# Altium project Sirius_Black.PrjPcb (part 1 of 2)
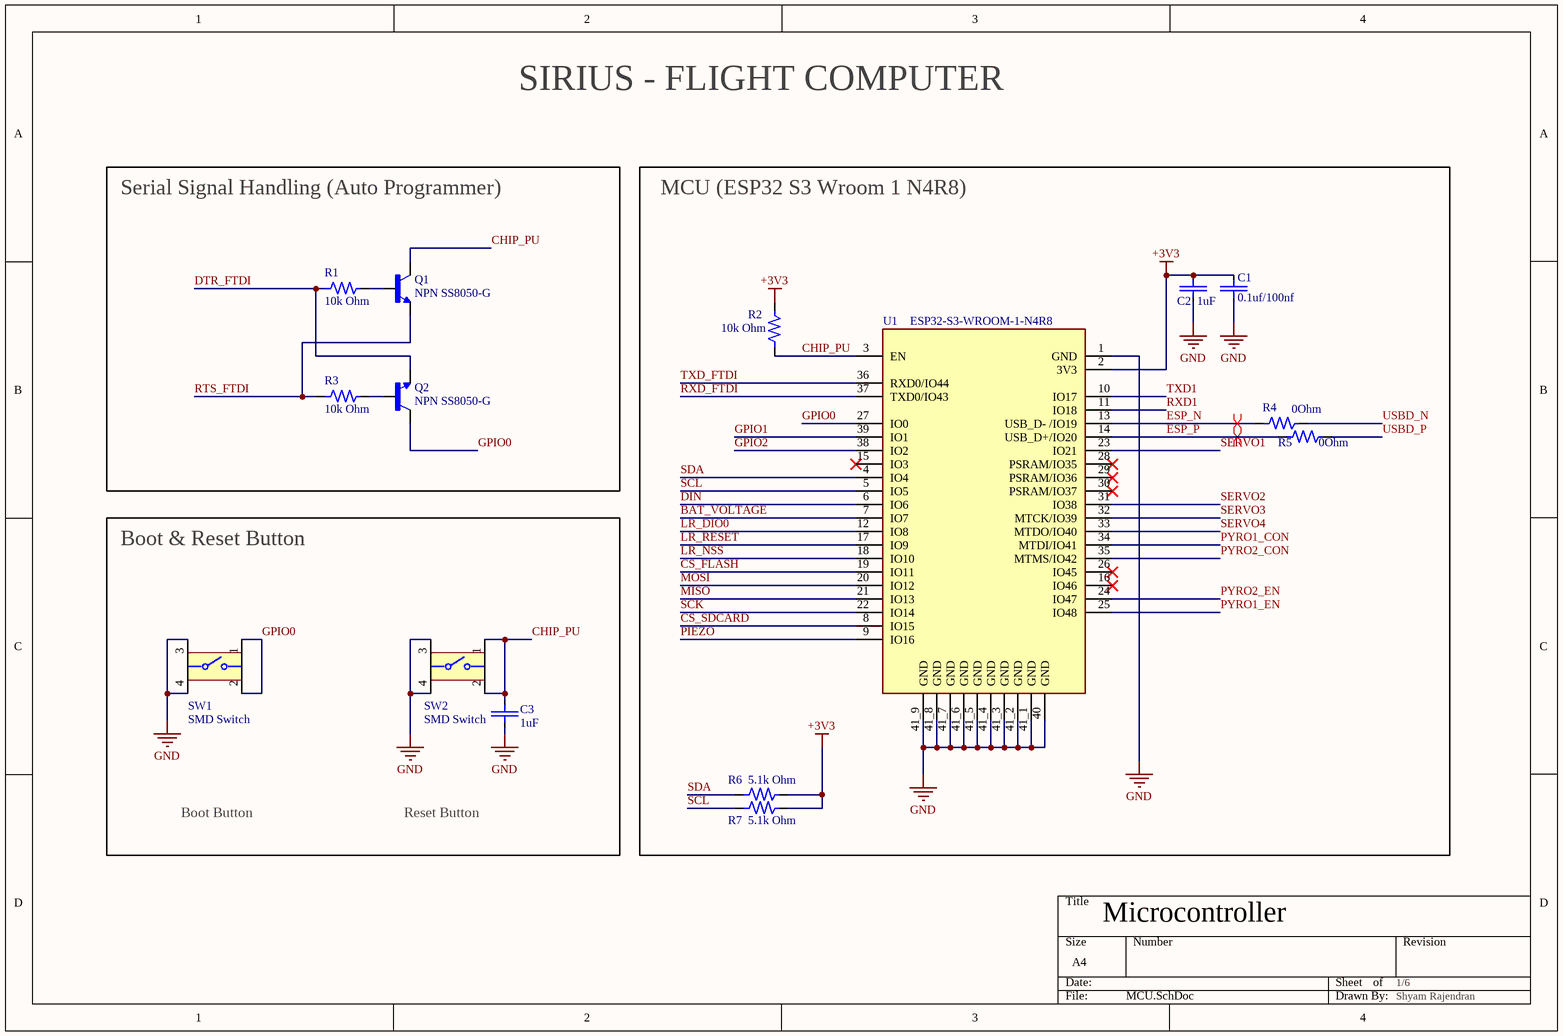
[diagram p0: MCU.SchDoc]
6 sheets, 175 parts. Net scope: global (net labels, ports and power ports of the same name join across sheets).
Board file: PCB1.PcbDoc
Sheets:
  MCU.SchDoc
  USB.SchDoc
  Power Distribution.SchDoc
  Sensor Suite 1.SchDoc
  Sensor Suite 2.SchDoc
  Pyro Channel.SchDoc

## Sheet MCU.SchDoc
size A4; SheetNumber: 1; SheetTotal: 6

### Parts
C1  0.1uf/100nf  [0.1uF Capacitor]
C2  1uF  [10uf Capacitor]
C3  1uF  [10uf Capacitor]
Q1  NPN SS8050-G  [Transistor_SS8050-G]
Q2  NPN SS8050-G  [Transistor_SS8050-G]
R1  10k Ohm  [RESC2013X60X35ML10T20]
R2  10k Ohm  [RESC2013X60X35ML10T20]
R3  10k Ohm  [RESC2013X60X35ML10T20]
R4  0Ohm  [1k 0805 Resistor]
R5  0Ohm  [1k 0805 Resistor]
R6  5.1k Ohm  [RESC2012X60N]
R7  5.1k Ohm  [RESC2012X60N]
SW1  SMD Switch  [Oval Switch]
SW2  SMD Switch  [Oval Switch]
U1  ESP32-S3-WROOM-1-N4R8  [ESP32-S3-WROOM-1-N4]

### Blocks framed on the sheet
Serial Signal Handling (Auto Programmer): Q1 Q2 R1 R3
MCU (ESP32 S3 Wroom 1 N4R8): C1 C2 R2 R4-R7 U1
Boot & Reset Button: C3 SW1 SW2

### Nets
+3V3: C1.1 C2.2 R2.2 R6.2 R7.2 U1.2(3V3)
GND: C1.2 C2.1 C3.1 SW1.3 SW1.4 SW2.3 SW2.4 U1.1(GND) U1.40(GND) U1.41_1(GND) U1.41_2(GND) U1.41_3(GND) U1.41_4(GND) U1.41_5(GND) U1.41_6(GND) U1.41_7(GND) U1.41_8(GND) U1.41_9(GND)
BAT_VOLTAGE: U1.7(IO7)
CHIP_PU: C3.2 Q1.3(C) R2.1 SW2.1 SW2.2 U1.3(EN)
CS_FLASH: U1.19(IO11)
CS_SDCARD: U1.8(IO15)
DIN: U1.6(IO6)
DTR_FTDI: Q2.2(E) R1.1
ESP_N: R4.1 U1.13(USB_D-_/IO19)
ESP_P: R5.1 U1.14(USB_D+/IO20)
GPIO0: Q2.3(C) SW1.1 SW1.2 U1.27(IO0)
GPIO1: U1.39(IO1)
GPIO2: U1.38(IO2)
LR_DIO0: U1.12(IO8)
LR_NSS: U1.18(IO10)
LR_RESET: U1.17(IO9)
MISO: U1.21(IO13)
MOSI: U1.20(IO12)
PIEZO: U1.9(IO16)
PYRO1_CON: U1.34(MTDI/IO41)
PYRO1_EN: U1.25(IO48)
PYRO2_CON: U1.35(MTMS/IO42)
PYRO2_EN: U1.24(IO47)
RTS_FTDI: Q1.2(E) R3.1
RXD1: U1.11(IO18)
RXD_FTDI: U1.37(TXD0/IO43)
SCK: U1.22(IO14)
SCL: R7.1 U1.5(IO5)
SDA: R6.1 U1.4(IO4)
SERVO1: U1.23(IO21)
SERVO2: U1.31(IO38)
SERVO3: U1.32(MTCK/IO39)
SERVO4: U1.33(MTDO/IO40)
TXD1: U1.10(IO17)
TXD_FTDI: U1.36(RXD0/IO44)
USBD_N: R4.2
USBD_P: R5.2
NetQ1_1: Q1.1(B) R1.2
NetQ2_1: Q2.1(B) R3.2

Not connected (* = marked no-connect by the designer): U1 15(IO3)* 16(IO46)* 26(IO45)* 28(PSRAM/IO35)* 29(PSRAM/IO36)* 30(PSRAM/IO37)*

### Layout directives
differential pair; differential pair class DIFF90: ESP_N, ESP_P

### Notes on the sheet
- SIRIUS - FLIGHT COMPUTER
- Boot Button
- Reset Button
- Microcontroller <BMP280>
- 1/6 <BMP280>
- Shyam Rajendran <BMP280>

### Library data of the parts
C1 = CC0805KRX7R9BB104: 0.1 uF, Multilayer Ceramic Capacitor, 50 V, ï¿½ 10%, X7R, 0805 [2012 Metric]; Manufacturer: Yageo; Value: 100nF; Voltage Rating: 50V; Insulation Resistance: 100GR; Supplier: Future Electronics; Supplier Part Number: 2986263; Manufacturer Part Number: CC0805KRX7R9BB104; RoHS: Yes; Category: Ceramic Capacitors; Stock: 2884000; Pricing: 4000=0.009, 12000=0.0088, 40000=0.0085, 80000=0.0083, 160000=0.008 (USD); Mounting Technology: Surface Mount; Case/Package: 0805; Pins: 2; Case Code (Metric): 2012; Case Code (Imperial): 0805; Material: Ceramic; Min Operating Temperature: -55°C; Max Operating Temperature: 125°C; Packaging: Tape and Reel; Tolerance: 10%; Dielectric: X7R; Series: CC; Package Quantity: 4000; Voltage: 50V; Termination: SMD/SMT; Length: 2mm; Height: 0.85mm; Depth: 1.25mm; Radiation Hardening: No; RoHS Compliant: Yes; Lead Free: 5697LeadFree; Reach SVHC Compliant: No; Halogen Free: 5694HalogenFree
C2 C3 = CC0805KKX7R6BB105: 1uF, Ceramic Capacitor, Multilayer, Ceramic, 10V, 10% +Tol, 10% -Tol, X7R, 15% TC,Surface Mount, 0805; Manufacturer: Yageo; Multilayer: Yes; Supplier: Future Electronics; Supplier Part Number: 2015429; Manufacturer Part Number: CC0805KKX7R6BB105; RoHS: Yes; Category: Ceramic Capacitors; Stock: 114000; Pricing: 3000=0.0123, 9000=0.012, 30000=0.0117, 60000=0.0116, 120000=0.0112 (USD); Mounting Technology: Surface Mount; Pins: 2; Dielectric Material: Ceramic; Package Shape: Rectangular; Case/Package: 0805; Terminal Finish: Nickel; Min Operating Temperature: -55°C; Max Operating Temperature: 125°C; JESD-609 Code: e3; Value: 1uF; Capacitor Type: Ceramic; Tolerance  (fill in as +-): 10%; Packaging: Tape and Reel; Tolerance (fill in as +-): 10%; Rated DC Voltage (URdc): 10V; Temperature Characteristics Code: X7R; Termination: Wraparound; Package Style: SMTMeter; Length: 2mm; Width: 1.25mm; Height: 1.25mm; Reach SVHC Compliant: Yes; RoHS Compliant: Yes; ComponentLink1URL: https://datasheet.ciiva.com:443/pdfs/VipMasterIC/IC/YAGO/YAGO-S-A0003557223/YAGO-S-A0003557223-1.pdf?src-supplier=IHS+Markit; ComponentLink1Description: https://datasheet.ciiva.com:443/pdfs/VipMasterIC/IC/YAGO/YAGO-S-A0003557223/YAGO-S-A0003557223-1.pdf?src-supplier=IHS+Markit
Q1 Q2 = SS8050-G: Trans Gp Bjt NPN 25V 1.5A 300MW 3-PIN SOT-23 T/r; Manufacturer: Comchip; Transition Frequency: 100MHz; Collector-emitter Voltage-Max: 400mV; Collector Base Voltage (VCBO): 40V; Collector Emitter Saturation Voltage: 500mV; Emitter Base Voltage (VEBO): 5V; hFE Min: 200; Number of Elements: 1; Supplier: Digikey; Supplier Part Number: 641-1790-1-ND; Manufacturer Part Number: SS8050-G; RoHS: Yes; Category: Transistors; Stock: 150601; Pricing: 1=0.24, 10=0.148, 100=0.0921, 500=0.06754, 1000=0.05958 (USD); Mounting Technology: Surface Mount; Case/Package: TO-236-3; Max Operating Temperature: 150°C; Packaging: Cut Tape; Max Collector Current: 1.5A; Max Power Dissipation: 300mW; Collector Emitter Breakdown Voltage: 25V; Max Breakdown Voltage: 25V; Series: -; Power Dissipation: 300mW; Height: 1.15mm; RoHS Compliant: Yes; ComponentLink1URL: http://www.comchiptech.com/admin/files/product/SS8050-G RevA181526.pdf?src-supplier=Digikey; ComponentLink1Description: http://www.comchiptech.com/admin/files/product/SS8050-G RevA181526.pdf?src-supplier=Digikey
R1-R3 = RC0805FR-0710KL: 10 kOhm, SMD Chip Resistor, ï¿½ 1%, 125 mW, 0805 [2012 Metric], Thick Film, General Purpose; Manufacturer: Yageo; Value: 10kR; Power Rating: 125mW; Voltage Rating: 150V; Temperature Coefficient: 100ppm/°C; Supplier: Future Electronics; Supplier Part Number: 3310877; Manufacturer Part Number: RC0805FR-0710KL; RoHS: Yes; Category: Chip SMD Resistors; Stock: 15945000; Pricing: 5000=0.0021, 20000=0.002, 100000=0.0019, 200000=0.0018, 625000=0.0017 (USD); Case/Package: 0805; Case Code (Imperial): 0805; Case Code (Metric): 2012; Min Operating Temperature: -55°C; Max Operating Temperature: 155°C; Packaging: Tape and Reel; Tolerance: 1%; Termination: SMD/SMT; Number of Terminations: 2; Max Power Dissipation: 125mW; Features: Moisture Resistant; Series: RC; Resistor Type: Thick Film; Construction: Rectangular; Resistance Tolerance: 1%; Package Quantity: 1; Technology: THICK FILM; Voltage Rating (AC): 150V; Length: 0.079inch; Width: 0.049inch; Height: 0.024inch; Depth: 1.25mm; Lead Free: Lead Free; RoHS Compliant: Yes; Military Standard: Not; Reach SVHC Compliant: Unknown; ComponentLink1URL: https://datasheet.ciiva.com/11808/0900766b8106beab-11808151.pdf?src-supplier=Rs; ComponentLink1Description: https://datasheet.ciiva.com/11808/0900766b8106beab-11808151.pdf?src-supplier=Rs; ComponentLink2URL: https://datasheet.ciiva.com/46447/444164-46447563.pdf?src-supplier=Element14; ComponentLink2Description: https://datasheet.ciiva.com/46447/444164-46447563.pdf?src-supplier=Element14; ComponentLink3URL: https://datasheet.ciiva.com/2456/pyu-r-int-thick-7-2456973.pdf?src-supplier=Digikey; ComponentLink3Description: https://datasheet.ciiva.com/2456/pyu-r-int-thick-7-2456973.pdf?src-supplier=Digikey; ComponentLink4URL: https://datasheet.ciiva.com/2456/pyu-r-int-thick-7-2456974.pdf?src-supplier=Digikey; ComponentLink4Description: https://datasheet.ciiva.com/2456/pyu-r-int-thick-7-2456974.pdf?src-supplier=Digikey; ComponentLink5URL: https://datasheet.ciiva.com/2456/pyu-r-int-thick-7-2456972.pdf?src-supplier=Digikey; ComponentLink5Description: https://datasheet.ciiva.com/2456/pyu-r-int-thick-7-2456972.pdf?src-supplier=Digikey; ComponentLink6URL: https://datasheet.ciiva.com/12669/rc0805-12669688.pdf?src-supplier=Mouser; ComponentLink6Description: https://datasheet.ciiva.com/12669/rc0805-12669688.pdf?src-supplier=Mouser; ComponentLink7URL: https://datasheet.ciiva.com/16747/rc0805-16747087.pdf?src-supplier=Future+Electronics; ComponentLink7Description: https://datasheet.ciiva.com/16747/rc0805-16747087.pdf?src-supplier=Future+Electronics
R4 R5 = CRCW08050000Z0EA: 0 Ohm Resistor, Jumper, 0805 [2012 Metric], Thick Film, 125 mW, Surface Mount; Manufacturer: Vishay; Value: 0mR; Power Rating: 125mW; Temperature Coefficient: 100ppm/°C; Voltage Rating: 150V; Tolerance: 1%; Supplier: Arrow Electronics; Supplier Part Number: CRCW08050000Z0EA; Manufacturer Part Number: CRCW08050000Z0EA; RoHS: Yes; Category: Chip SMD Resistors; Stock: 1390000; Pricing: 5000=0.0051, 10000=0.005, 15000=0.0049, 25000=0.0045 (USD); Case/Package: 0805; Case Code (Imperial): 0805; Case Code (Metric): 2012; Contact Plating: Tin; Weight: 0.000194oz; Min Operating Temperature: -55°C; Max Operating Temperature: 155°C; Packaging: Tape and Reel; Series: CRCW; Number of Terminations: 2; Resistor Type: Thick Film; Termination: SMD/SMT; Max Power Dissipation: 125mW; Package Quantity: 1; Features: Automotive AEC-Q200; Construction: Rectangular; Technology: THICK FILM; Voltage Rating (DC): 150V; Resistance Tolerance: 1%; Length: 2mm; Width: 0.049inch; Height: 0.45mm; Depth: 1.25mm; Radiation Hardening: No; RoHS Compliant: Yes; Military Standard: Not; Reach SVHC Compliant: Unknown; Lead Free: 5697LeadFree; ComponentLink1URL: https://datasheet.ciiva.com/11811/0900766b80d98b26-11811304.pdf?src-supplier=Rs; ComponentLink1Description: https://datasheet.ciiva.com/11811/0900766b80d98b26-11811304.pdf?src-supplier=Rs; ComponentLink2URL: https://datasheet.ciiva.com/7841/1720486-7841839.pdf?src-supplier=Element14; ComponentLink2Description: https://datasheet.ciiva.com/7841/1720486-7841839.pdf?src-supplier=Element14; ComponentLink3URL: https://datasheet.ciiva.com/26314/fld-crcw-e3-data-en-26314630.pdf?src-supplier=Distrelec; ComponentLink3Description: https://datasheet.ciiva.com/26314/fld-crcw-e3-data-en-26314630.pdf?src-supplier=Distrelec; ComponentLink4URL: https://datasheet.ciiva.com/7841/1697337-7841629.pdf?src-supplier=Element14; ComponentLink4Description: https://datasheet.ciiva.com/7841/1697337-7841629.pdf?src-supplier=Element14; ComponentLink5URL: https://datasheet.ciiva.com/2463/dcrcwe3-2463038.pdf?src-supplier=Digikey; ComponentLink5Description: https://datasheet.ciiva.com/2463/dcrcwe3-2463038.pdf?src-supplier=Digikey; ComponentLink6URL: https://datasheet.ciiva.com/2463/dcrcwe3-2463039.pdf?src-supplier=Digikey; ComponentLink6Description: https://datasheet.ciiva.com/2463/dcrcwe3-2463039.pdf?src-supplier=Digikey; ComponentLink7URL: https://datasheet.ciiva.com/2463/dcrcwe3-2463037.pdf?src-supplier=Digikey; ComponentLink7Description: https://datasheet.ciiva.com/2463/dcrcwe3-2463037.pdf?src-supplier=Digikey; ComponentLink8URL: https://datasheet.ciiva.com/16719/70201119-16719706.pdf?src-supplier=Allied+Electronics; ComponentLink8Description: https://datasheet.ciiva.com/16719/70201119-16719706.pdf?src-supplier=Allied+Electronics; ComponentLink9URL: https://datasheet.ciiva.com/5543/dcrcwe3-109170-5543096.pdf?src-supplier=Mouser; ComponentLink9Description: https://datasheet.ciiva.com/5543/dcrcwe3-109170-5543096.pdf?src-supplier=Mouser; ComponentLink10URL: https://datasheet.ciiva.com/16389/dcrcwe3-16389338.pdf?src-supplier=Future+Electronics; ComponentLink10Description: https://datasheet.ciiva.com/16389/dcrcwe3-16389338.pdf?src-supplier=Future+Electronics
R6 R7 = RC0805FR-075K1L: 5.1k Ohm, 0805, 0.125W, 150V, 1% +/-Tol, 100ppm/Cel, Surface Mount; Manufacturer: Yageo; Additional Feature: LASER TRIMMABLE; Power: 125mW; Rated Temperature: 70°C; Value: 5.1kR; Temperature Coefficient (ppm/Cel): 100; Package Height: 0.5mm; Package Length: 2mm; Package Width: 1.25mm; Supplier: Future Electronics; Supplier Part Number: 5647425; Manufacturer Part Number: RC0805FR-075K1L; RoHS: Yes; Category: Chip SMD Resistors; Stock: 15000; Pricing: 5000=0.0021, 20000=0.002, 100000=0.0019, 200000=0.0018, 625000=0.0017 (USD); Mounting Technology: Surface Mount; Pins: 2; Package Shape: Rectangular; Case/Package: 0805; Terminal Finish: Nickel; Min Operating Temperature: -55°C; Max Operating Temperature: 155°C; Tolerance: 1%; JESD-609 Code: e3; Termination: Wraparound; Resistor Type: FIXED RESISTOR; Construction: Chip; Packaging: Tape and Reel; Technology: METAL GLAZE/THICK FILM; Working Voltage: 150V; Reach SVHC Compliant: Yes; RoHS Compliant: Yes; ComponentLink1URL: https://datasheet.ciiva.com:443/pdfs/VipMasterIC/IC/YAGO/YAGO-S-A0008145938/YAGO-S-A0008145938-1.pdf?src-supplier=IHS+Markit; ComponentLink1Description: https://datasheet.ciiva.com:443/pdfs/VipMasterIC/IC/YAGO/YAGO-S-A0008145938/YAGO-S-A0008145938-1.pdf?src-supplier=IHS+Markit; ComponentLink2URL: https://datasheet.ciiva.com/11808/0900766b8106beab-11808171.pdf?src-supplier=Rs; ComponentLink2Description: https://datasheet.ciiva.com/11808/0900766b8106beab-11808171.pdf?src-supplier=Rs; ComponentLink3URL: https://datasheet.ciiva.com/2456/pyu-r-int-thick-7-2456979.pdf?src-supplier=Digikey; ComponentLink3Description: https://datasheet.ciiva.com/2456/pyu-r-int-thick-7-2456979.pdf?src-supplier=Digikey; ComponentLink4URL: https://datasheet.ciiva.com/2456/pyu-r-int-thick-7-2456980.pdf?src-supplier=Digikey; ComponentLink4Description: https://datasheet.ciiva.com/2456/pyu-r-int-thick-7-2456980.pdf?src-supplier=Digikey; ComponentLink5URL: https://datasheet.ciiva.com/15189/getdatasheetpartid-326574-15189996.pdf?src-supplier=Verical; ComponentLink5Description: https://datasheet.ciiva.com/15189/getdatasheetpartid-326574-15189996.pdf?src-supplier=Verical; ComponentLink6URL: https://datasheet.ciiva.com/2456/pyu-r-int-thick-7-2456978.pdf?src-supplier=Digikey; ComponentLink6Description: https://datasheet.ciiva.com/2456/pyu-r-int-thick-7-2456978.pdf?src-supplier=Digikey
SW1 SW2 = Oval Switch: PTS810SJG250SMTRLFS, Keypad Switch, 1 Switches, SPST, Momentary-tactile, 0.05A, 16VDC, 4.9N, Solder Terminal, Surface Mount-straight; Manufacturer: ITT C&K; Actuator Color: Blue; Actuator Type: Pushbutton; Contact Resistance: 0.5mR; Dielectric Withstand Volts: 250VACV; Insulation Resistance: 100MR; Solderability: REFLOW; Actuator Travel: 0.2032mm; Electrical Life: 100000Cycles; Actuator Length: 0.028inch; Supplier: Digikey; Supplier Part Number: CKN10504CT-ND; Manufacturer Part Number: PTS810SJG250SMTRLFS; RoHS: Yes; Category: Tactile Switches; Stock: 44414; Pricing: 1=0.55, 10=0.478, 25=0.452, 100=0.4154, 250=0.39256, 500=0.37598, 1000=0.36001 (USD); Mounting Technology: Surface Mount; Terminal Finish: Silver; Min Operating Temperature: -40°C; Max Operating Temperature: 85°C; Switch Action: MOMENTARY; Switch Function: SPST; Switch Type: Keypad; Termination: Solder; JESD-609 Code: e4; RoHS Compliant: Yes; Reach SVHC Compliant: Yes; ComponentLink1URL: https://datasheet.ciiva.com:443/pdfs/VipMasterIC/IC/CKCI/CKCI-S-A0001404160/CKCI-S-A0001797319-1.pdf?src-supplier=IHS+Markit; ComponentLink1Description: https://datasheet.ciiva.com:443/pdfs/VipMasterIC/IC/CKCI/CKCI-S-A0001404160/CKCI-S-A0001797319-1.pdf?src-supplier=IHS+Markit; ComponentLink2URL: https://datasheet.ciiva.com/18514/pts810-4mar13-18514165.pdf?src-supplier=Digikey; ComponentLink2Description: https://datasheet.ciiva.com/18514/pts810-4mar13-18514165.pdf?src-supplier=Digikey; ComponentLink3URL: https://datasheet.ciiva.com/18514/pts810-4mar13-18514166.pdf?src-supplier=Digikey; ComponentLink3Description: https://datasheet.ciiva.com/18514/pts810-4mar13-18514166.pdf?src-supplier=Digikey; ComponentLink4URL: https://datasheet.ciiva.com/18514/pts810-4mar13-18514167.pdf?src-supplier=Digikey; ComponentLink4Description: https://datasheet.ciiva.com/18514/pts810-4mar13-18514167.pdf?src-supplier=Digikey
U1 = ESP32-S3-WROOM-1-N4R8: SMD Module, ESP32-S3, 4 mb Spi F; Manufacturer: Espressif Systems; Supplier: Digikey; Supplier Part Number: 1965-ESP32-S3-WROOM-1-N4CT-ND; Manufacturer Part Number: ESP32-S3-WROOM-1-N4; RoHS: No; Category: LDO; Stock: 2269; Pricing: 1=2.95 (USD); ComponentLink1URL: https://datasheet.octopart.com/ESP32-S3-WROOM-1-N4-Espressif-Systems-datasheet-165560563.pdf?src-supplier=TME; ComponentLink1Description: https://datasheet.octopart.com/ESP32-S3-WROOM-1-N4-Espressif-Systems-datasheet-165560563.pdf?src-supplier=TME

## Sheet USB.SchDoc
size A4; SheetNumber: 2; SheetTotal: 6
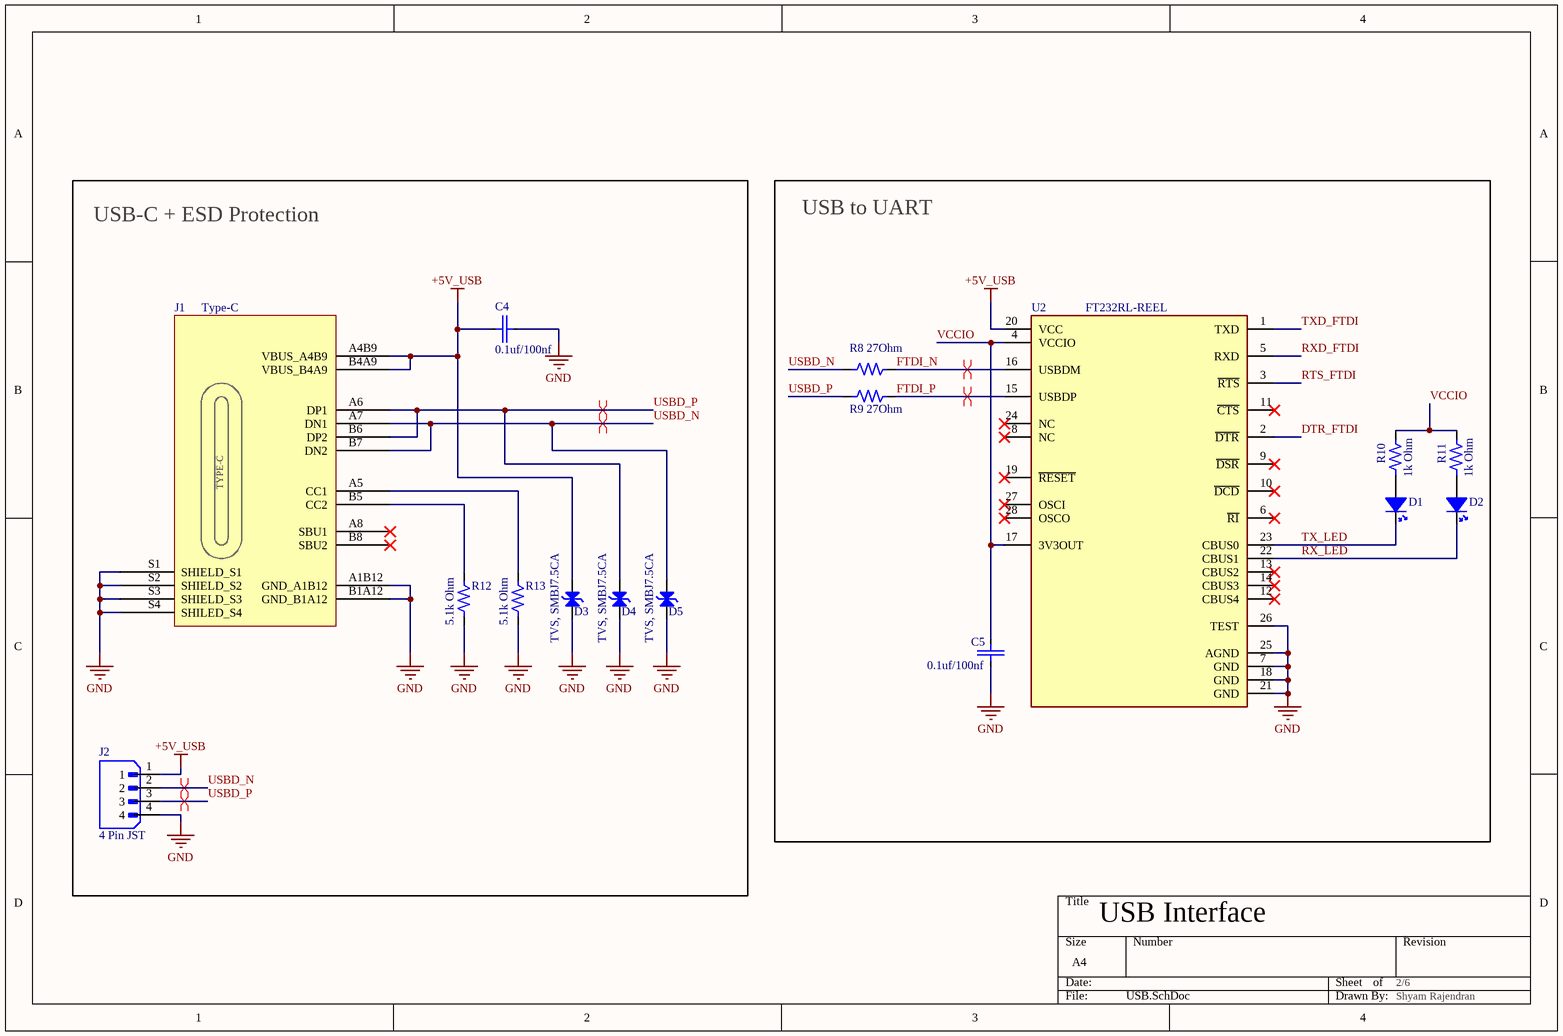
[diagram p1: USB.SchDoc]

### Parts
C4  0.1uf/100nf  [0.1uF Capacitor]
C5  0.1uf/100nf  [0.1uF Capacitor]
D1  Blue, 0805  [led blue]  (value not drawn)
D2  Blue, 0805  [led blue]  (value not drawn)
D3  TVS, SMBJ7.5CA  [TVS Diode]
D4  TVS, SMBJ7.5CA  [TVS Diode]
D5  TVS, SMBJ7.5CA  [TVS Diode]
J1  Type-C  [Type C]
J2  4 Pin JST  [JST_B4B-XH-A]
R8  27Ohm  [1k 0805 Resistor]
R9  27Ohm  [1k 0805 Resistor]
R10  1k Ohm  [1k 0805 Resistor]
R11  1k Ohm  [1k 0805 Resistor]
R12  5.1k Ohm  [RESC2012X60N]
R13  5.1k Ohm  [RESC2012X60N]
U2  FT232RL-REEL  [FP-SSOP-28-IPC_B]

### Blocks framed on the sheet
USB-C + ESD Protection: C4 D3-D5 J1 J2 R12 R13
USB to UART: C5 D1 D2 R8-R11 U2

### Nets
+5V_USB: C4.2 D3.2 J1.A4B9(VBUS_A4B9) J1.B4A9(VBUS_B4A9) J2.1 U2.20(VCC)
GND: C4.1 C5.1 D3.1 D4.1 D5.1 J1.A1B12(GND_A1B12) J1.B1A12(GND_B1A12) J1.S1(SHIELD_S1) J1.S2(SHIELD_S2) J1.S3(SHIELD_S3) J1.S4(SHILED_S4) J2.4 R12.1 R13.1 U2.7(GND) U2.18(GND) U2.21(GND) U2.25(AGND) U2.26(TEST)
DTR_FTDI: U2.2(~{DTR})
FTDI_N: R8.2 U2.16(USBDM)
FTDI_P: R9.2 U2.15(USBDP)
RTS_FTDI: U2.3(~{RTS})
RX_LED: D2.C U2.22(CBUS1)
RXD_FTDI: U2.5(RXD)
TX_LED: D1.C U2.23(CBUS0)
TXD_FTDI: U2.1(TXD)
USBD_N: D5.2 J1.A7(DN1) J1.B7(DN2) J2.2 R8.1
USBD_P: D4.2 J1.A6(DP1) J1.B6(DP2) J2.3 R9.1
VCCIO: C5.2 R10.2 R11.2 U2.4(VCCIO) U2.17(3V3OUT)
NetD1_A: D1.A R10.1
NetD2_A: D2.A R11.1
NetJ1_A5: J1.A5(CC1) R13.2
NetJ1_B5: J1.B5(CC2) R12.2

Not connected (* = marked no-connect by the designer): J1 A8(SBU1)* B8(SBU2)*; U2 6(~{RI})* 8(NC)* 9(~{DSR})* 10(~{DCD})* 11(~{CTS})* 12(CBUS4)* 13(CBUS2)* 14(CBUS3)* 19(~{RESET})* 24(NC)* 27(OSCI)* 28(OSCO)*

### Layout directives
differential pair; differential pair class DIFF90: FTDI_N, FTDI_P, USBD_N, USBD_P
differential pair: USBD_N, USBD_P

### Notes on the sheet
- USB Interface <BMP280>
- 2/6 <BMP280>
- Shyam Rajendran <BMP280>
- (in symbol Type-C) TYPE-C

### Library data of the parts
C4 C5 = CC0805KRX7R9BB104: as C1 on sheet MCU; Supplier: Future Electronics; Supplier Part Number: 2986263; Manufacturer Part Number: CC0805KRX7R9BB104; RoHS: Yes; Category: Ceramic Capacitors; Stock: 2884000; Pricing: 4000=0.009, 12000=0.0088, 40000=0.0085, 80000=0.0083, 160000=0.008 (USD); Mounting Technology: Surface Mount; Case/Package: 0805; Pins: 2; Case Code (Metric): 2012; Case Code (Imperial): 0805; Material: Ceramic; Min Operating Temperature: -55°C; Max Operating Temperature: 125°C; Packaging: Tape and Reel; Tolerance: 10%; Dielectric: X7R; Series: CC; Package Quantity: 4000; Voltage: 50V; Termination: SMD/SMT; Length: 2mm; Height: 0.85mm; Depth: 1.25mm; Radiation Hardening: No; RoHS Compliant: Yes; Lead Free: 5697LeadFree; Reach SVHC Compliant: No; Halogen Free: 5694HalogenFree
D1 D2 = LED Blue
D3-D5 = SMBJ7.5CA: SMBJ Series 5 W 9.21 V Bi-Directional Surface Mount TVS Diode - SMB; Manufacturer: Littelfuse; Max Reverse Leakage Current: 100uA; Reverse Voltage: 7.5V; Supplier: Digikey; Supplier Part Number: SMBJ7.5CALFCT-ND; Manufacturer Part Number: SMBJ7.5CA; RoHS: Yes; Category: TVS Diodes; Stock: 3822; Pricing: 1=0.33, 10=0.215, 100=0.115, 500=0.113, 1000=0.111 (USD); ComponentLink1URL: https://datasheet.ciiva.com/15143/getdatasheetpartid-149559-15143802.pdf?src-supplier=Verical; ComponentLink1Description: https://datasheet.ciiva.com/15143/getdatasheetpartid-149559-15143802.pdf?src-supplier=Verical; ComponentLink2URL: https://datasheet.ciiva.com/16487/littelfuse-tvs-diode-smbj-16487753.pdf?src-supplier=Future+Electronics; ComponentLink2Description: https://datasheet.ciiva.com/16487/littelfuse-tvs-diode-smbj-16487753.pdf?src-supplier=Future+Electronics; ComponentLink3URL: https://datasheet.ciiva.com/331/littelfuse-tvs-diode-smbj-datasheet-pdf-331604.pdf?src-supplier=Digikey; ComponentLink3Description: https://datasheet.ciiva.com/331/littelfuse-tvs-diode-smbj-datasheet-pdf-331604.pdf?src-supplier=Digikey; ComponentLink4URL: https://datasheet.ciiva.com/331/littelfuse-tvs-diode-smbj-datasheet-pdf-331605.pdf?src-supplier=Digikey; ComponentLink4Description: https://datasheet.ciiva.com/331/littelfuse-tvs-diode-smbj-datasheet-pdf-331605.pdf?src-supplier=Digikey; ComponentLink5URL: https://datasheet.ciiva.com/331/littelfuse-tvs-diode-smbj-datasheet-pdf-331606.pdf?src-supplier=Digikey; ComponentLink5Description: https://datasheet.ciiva.com/331/littelfuse-tvs-diode-smbj-datasheet-pdf-331606.pdf?src-supplier=Digikey; ComponentLink6URL: https://datasheet.ciiva.com/331/littelfuse-tvs-diode-smbj-datasheet-pdf-331616.pdf?src-supplier=Digikey; ComponentLink6Description: https://datasheet.ciiva.com/331/littelfuse-tvs-diode-smbj-datasheet-pdf-331616.pdf?src-supplier=Digikey; ComponentLink7URL: https://datasheet.ciiva.com/331/littelfuse-tvs-diode-smbj-datasheet-pdf-331617.pdf?src-supplier=Digikey; ComponentLink7Description: https://datasheet.ciiva.com/331/littelfuse-tvs-diode-smbj-datasheet-pdf-331617.pdf?src-supplier=Digikey; ComponentLink8URL: https://datasheet.ciiva.com/8062/13057-8062350.pdf?src-supplier=Element14; ComponentLink8Description: https://datasheet.ciiva.com/8062/13057-8062350.pdf?src-supplier=Element14
J1 = Type-C: USB Connector, 16 Contact(s), Female, Right Angle, Surface Mount Terminal, Locking, Receptacle; Manufacturer: Molex; Manufacturer Part Number: 217179-0001; USB Standard: USB 2.0; Current Rating: 1.25A; Number of Contacts: 16; Voltage Rating: 30V; Supplier: Avnet; Supplier Part Number: 35AJ1973; RoHS: No; Category: Connectors; Stock: 7075; Pricing: 1=1.05, 25=0.707, 100=0.609, 250=0.592, 500=0.575 (USD); Contact Material: Nickel,Gold; Min Operating Temperature: -40°C; Max Operating Temperature: 85°C; Gender: Receptacle; Height: 3.36mm
J2 = B4B-XH-A-JST: Board Connector, 4 Contact(s), 1 Row(s), Male, Straight, Solder Terminal,; Supplier: Digikey; Supplier Part Number: 455-B4B-XH-A-ND; Manufacturer: JST; Manufacturer Part Number: B4B-XH-A; RoHS: Yes; Category: FFC / FPC; Stock: 199106; Pricing: 1=0.17, 10=0.149, 100=0.1262, 500=0.1126, 1000=0.10721, 5000=0.09569, 10000=0.09112 (USD); Orientation: 5491OrientationType; ComponentLink1URL: https://datasheet.ciiva.com/14155/xh-series-eng-tds-14155433.pdf?src-supplier=Distrelec; ComponentLink1Description: https://datasheet.ciiva.com/14155/xh-series-eng-tds-14155433.pdf?src-supplier=Distrelec
R8 R9 = RT0805FRE0727RL: 27 Ohm, Res Thin Film 0805 1% 1/8W ±50ppm/°C Molded SMD SMD Paper T/R; Manufacturer: Yageo; Value: 27R; Power Rating: 125mW; Voltage Rating (DC): 150V; Supplier: Future Electronics; Supplier Part Number: 9105398; Manufacturer Part Number: RT0805FRE0727RL; RoHS: Yes; Category: Chip SMD Resistors; Stock: 30000; Pricing: 5000=0.0055, 20000=0.0053, 50000=0.0051, 125000=0.005, 200000=0.0048 (USD); Case/Package: 0805; Pins: 2; Case Code (Metric): 2012; Case Code (Imperial): 0805; Contact Plating: Tin,Matte; Min Operating Temperature: -55°C; Max Operating Temperature: 125°C; Tolerance: 1%; Packaging: Tape and Reel; Package Quantity: 5000; Number of Terminations: 2; Temperature Coefficient: 50ppm/°C; Max Power Dissipation: 125mW; Series: RT; Voltage Rating: 150V; Resistor Type: Thin Film; Termination: SMD/SMT; Resistance Tolerance: 1%; Length: 0.079inch; Width: 0.049inch; Height: 0.024inch; RoHS Compliant: Yes; Reach SVHC Compliant: Unknown; ComponentLink1URL: https://datasheet.ciiva.com/2561/pyu-rt-1-to-0-05-rohs-l-5-2561109.pdf?src-supplier=Digikey; ComponentLink1Description: https://datasheet.ciiva.com/2561/pyu-rt-1-to-0-05-rohs-l-5-2561109.pdf?src-supplier=Digikey; ComponentLink2URL: https://datasheet.ciiva.com/8889/pyu-rt-1-to-0-05-rohs-l-4-8889865.pdf?src-supplier=Avnet; ComponentLink2Description: https://datasheet.ciiva.com/8889/pyu-rt-1-to-0-05-rohs-l-4-8889865.pdf?src-supplier=Avnet; ComponentLink3URL: https://datasheet.ciiva.com/7942/1392914-7942123.pdf?src-supplier=Element14; ComponentLink3Description: https://datasheet.ciiva.com/7942/1392914-7942123.pdf?src-supplier=Element14; ComponentLink4URL: https://datasheet.ciiva.com/7942/1392914-7942124.pdf?src-supplier=Element14; ComponentLink4Description: https://datasheet.ciiva.com/7942/1392914-7942124.pdf?src-supplier=Element14
R10 R11 = RC0805FR-071KL: 1k Ohm, 0805, SMD Chip Resistor , ï¿½ 1%, 125 mW,[2012 Metric], Thick Film, General Purpose; Manufacturer: Yageo; Value: 1kR; Power Rating: 125mW; Voltage Rating: 150V; Temperature Coefficient: 100ppm/°C; Supplier: Future Electronics; Supplier Part Number: 8126013; Manufacturer Part Number: RC0805FR-071KL; RoHS: Yes; Category: Chip SMD Resistors; Stock: 5450000; Pricing: 5000=0.0021, 20000=0.002, 100000=0.0019, 200000=0.0018, 625000=0.0017 (USD); Case/Package: 0805; Pins: 2; Case Code (Metric): 2012; Case Code (Imperial): 0805; Min Operating Temperature: -55°C; Max Operating Temperature: 155°C; Tolerance: 1%; Packaging: Tape and Reel; Voltage Rating (DC): 150V; Resistor Type: Thick Film; Series: RC; Number of Terminations: 2; Termination: SMD/SMT; Max Power Dissipation: 125mW; Resistance Tolerance: 1%; Package Quantity: 1; Features: Moisture Resistant; Construction: Rectangular; Voltage Rating (AC): 150V; Length: 0.079inch; Width: 0.049inch; Height: 0.024inch; Depth: 1.25mm; RoHS Compliant: Yes; Reach SVHC Compliant: No; Military Standard: Not; Lead Free: Lead Free
R12 R13 = RC0805FR-075K1L: as R6 on sheet MCU; Supplier: Future Electronics; Supplier Part Number: 5647425; Manufacturer Part Number: RC0805FR-075K1L; RoHS: Yes; Category: Chip SMD Resistors; Stock: 15000; Pricing: 5000=0.0021, 20000=0.002, 100000=0.0019, 200000=0.0018, 625000=0.0017 (USD); Mounting Technology: Surface Mount; Pins: 2; Package Shape: Rectangular; Case/Package: 0805; Terminal Finish: Nickel; Min Operating Temperature: -55°C; Max Operating Temperature: 155°C; Tolerance: 1%; JESD-609 Code: e3; Termination: Wraparound; Resistor Type: FIXED RESISTOR; Construction: Chip; Packaging: Tape and Reel; Technology: METAL GLAZE/THICK FILM; Working Voltage: 150V; Reach SVHC Compliant: Yes; RoHS Compliant: Yes; ComponentLink1URL: https://datasheet.ciiva.com:443/pdfs/VipMasterIC/IC/YAGO/YAGO-S-A0008145938/YAGO-S-A0008145938-1.pdf?src-supplier=IHS+Markit; ComponentLink1Description: https://datasheet.ciiva.com:443/pdfs/VipMasterIC/IC/YAGO/YAGO-S-A0008145938/YAGO-S-A0008145938-1.pdf?src-supplier=IHS+Markit; ComponentLink2URL: https://datasheet.ciiva.com/11808/0900766b8106beab-11808171.pdf?src-supplier=Rs; ComponentLink2Description: https://datasheet.ciiva.com/11808/0900766b8106beab-11808171.pdf?src-supplier=Rs; ComponentLink3URL: https://datasheet.ciiva.com/2456/pyu-r-int-thick-7-2456979.pdf?src-supplier=Digikey; ComponentLink3Description: https://datasheet.ciiva.com/2456/pyu-r-int-thick-7-2456979.pdf?src-supplier=Digikey; ComponentLink4URL: https://datasheet.ciiva.com/2456/pyu-r-int-thick-7-2456980.pdf?src-supplier=Digikey; ComponentLink4Description: https://datasheet.ciiva.com/2456/pyu-r-int-thick-7-2456980.pdf?src-supplier=Digikey; ComponentLink5URL: https://datasheet.ciiva.com/15189/getdatasheetpartid-326574-15189996.pdf?src-supplier=Verical; ComponentLink5Description: https://datasheet.ciiva.com/15189/getdatasheetpartid-326574-15189996.pdf?src-supplier=Verical; ComponentLink6URL: https://datasheet.ciiva.com/2456/pyu-r-int-thick-7-2456978.pdf?src-supplier=Digikey; ComponentLink6Description: https://datasheet.ciiva.com/2456/pyu-r-int-thick-7-2456978.pdf?src-supplier=Digikey
U2 = FT232RL-REEL: USB Bus Controller, CMOS, PDSO28; Manufacturer: FTDI; Package Body Material: Plastic; Clock Frequency: 48MHz; Max Supply Current: 100uA; Max Supply Voltage: 5.25V; Min Supply Voltage: 3.3V; Qualification Status: Not Qualified; Supplier: Digikey; Supplier Part Number: 768-1007-1-ND; Manufacturer Part Number: FT232RL-REEL; RoHS: Yes; Category: Interface ICs; Stock: 4321; Pricing: 1=4.8, 10=4.35, 50=4.15, 100=3.95, 250=3.55, 500=3.15002, 1000=2.95001, 2000=2.95002 (USD); Case/Package: SSOP; Pins: 28; Package Shape: Rectangular; Min Operating Temperature: -40°C; Max Operating Temperature: 85°C; JESD-30 Code: R-PDSO-G28; Moisture Sensitivity Level: 3; Package Style: SMALL OUTLINE, SHRINK PITCHMeter; Surface Mount: Yes; Technology: CMOS; Terminal Form: Gull Wing; Terminal Position: DUAL; Length: 10.2mm; Width: 5.3mm; Height - Seated (Max): 2mm; Terminal Pitch: 0.65mm; Temperature Grade: INDUSTRIAL; Reach SVHC Compliant: Yes; RoHS Compliant: Yes; ComponentLink1URL: https://datasheet.ciiva.com:443/pdfs/VipMasterIC/IC/FTDI/FTDI-S-A0007980421/FTDI-S-A0007980421-1.pdf?src-supplier=IHS+Markit; ComponentLink1Description: https://datasheet.ciiva.com:443/pdfs/VipMasterIC/IC/FTDI/FTDI-S-A0007980421/FTDI-S-A0007980421-1.pdf?src-supplier=IHS+Markit; ComponentLink2URL: https://datasheet.ciiva.com/4787/ds-ft232r-11534-4787658.pdf?src-supplier=Mouser; ComponentLink2Description: https://datasheet.ciiva.com/4787/ds-ft232r-11534-4787658.pdf?src-supplier=Mouser; ComponentLink3URL: https://datasheet.ciiva.com/15150/getdatasheetpartid-643207-15150506.pdf?src-supplier=Verical; ComponentLink3Description: https://datasheet.ciiva.com/15150/getdatasheetpartid-643207-15150506.pdf?src-supplier=Verical; ComponentLink4URL: https://datasheet.ciiva.com/1787/ds-ft232r-1787048.pdf?src-supplier=Digikey; ComponentLink4Description: https://datasheet.ciiva.com/1787/ds-ft232r-1787048.pdf?src-supplier=Digikey; ComponentLink5URL: https://datasheet.ciiva.com/1787/ds-ft232r-1787047.pdf?src-supplier=Digikey; ComponentLink5Description: https://datasheet.ciiva.com/1787/ds-ft232r-1787047.pdf?src-supplier=Digikey; ComponentLink6URL: https://datasheet.ciiva.com/1787/ds-ft232r-1787049.pdf?src-supplier=Digikey; ComponentLink6Description: https://datasheet.ciiva.com/1787/ds-ft232r-1787049.pdf?src-supplier=Digikey; ComponentLink7URL: https://datasheet.ciiva.com/16200/ds-ft232r-16200652.pdf?src-supplier=Future+Electronics; ComponentLink7Description: https://datasheet.ciiva.com/16200/ds-ft232r-16200652.pdf?src-supplier=Future+Electronics

## Sheet Power Distribution.SchDoc
size A4; SheetNumber: 3; SheetTotal: 6
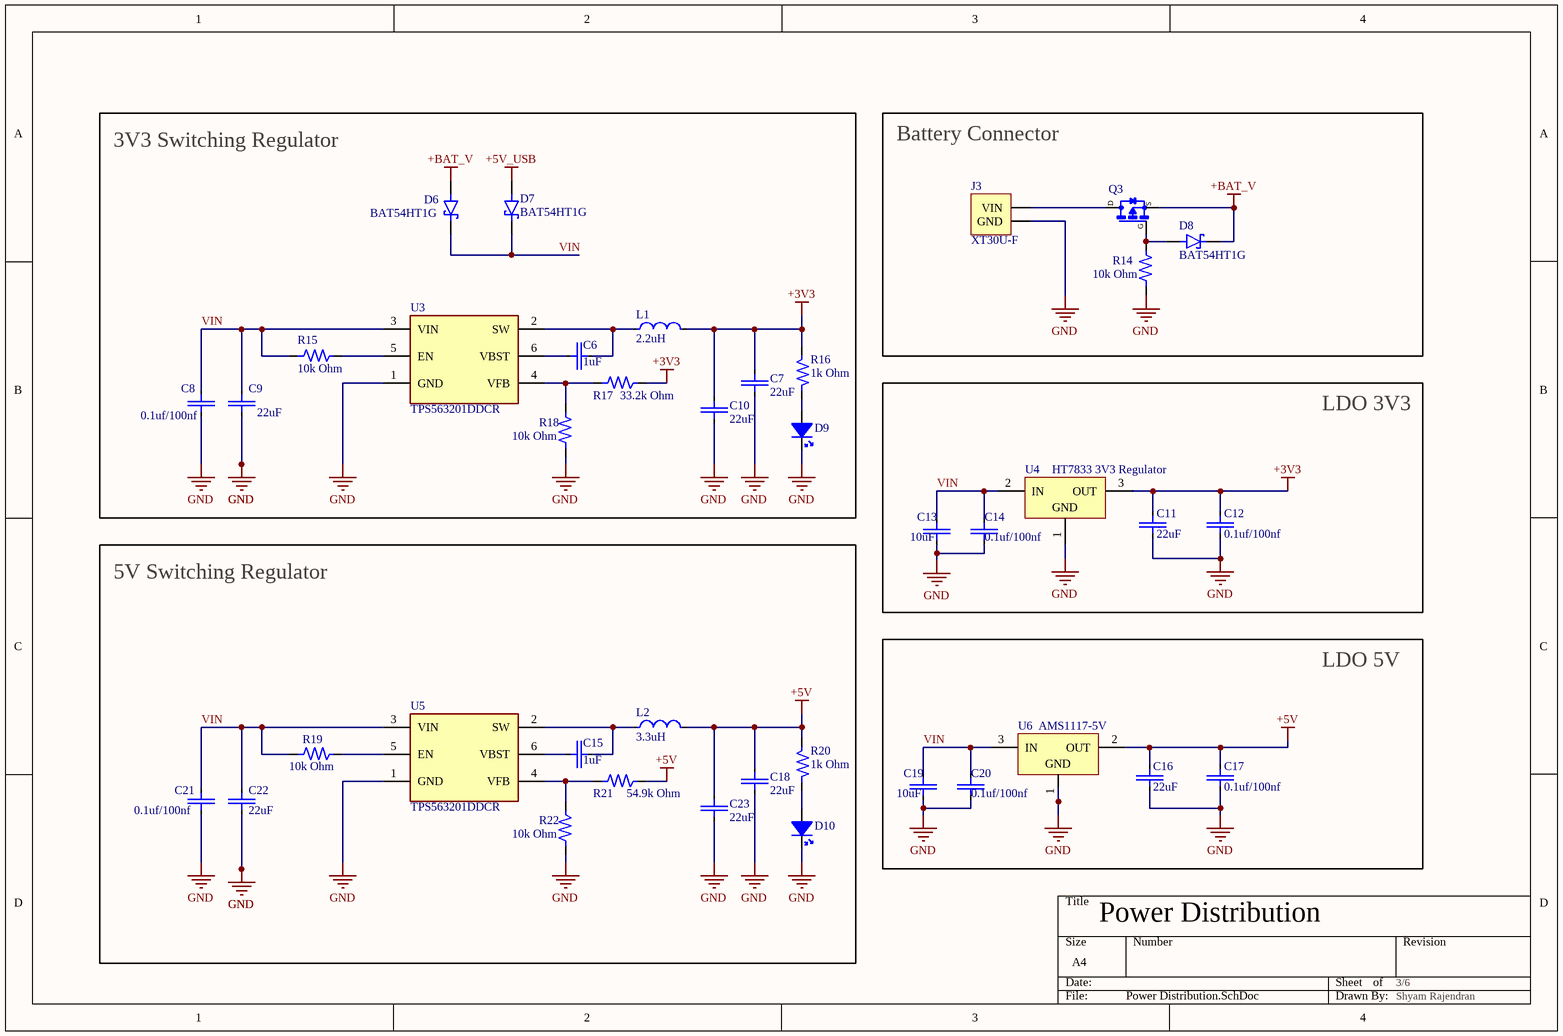
[diagram p2: Power Distribution.SchDoc]

### Parts
C6  1uF  [10uf Capacitor]
C7  22uF  [10uf Capacitor]
C8  0.1uf/100nf  [0.1uF Capacitor]
C9  22uF  [10uf Capacitor]
C10  22uF  [10uf Capacitor]
C11  22uF  [10uf Capacitor]
C12  0.1uf/100nf  [0.1uF Capacitor]
C13  10uF  [10uf Capacitor]
C14  0.1uf/100nf  [0.1uF Capacitor]
C15  1uF  [10uf Capacitor]
C16  22uF  [10uf Capacitor]
C17  0.1uf/100nf  [0.1uF Capacitor]
C18  22uF  [10uf Capacitor]
C19  10uF  [10uf Capacitor]
C20  0.1uf/100nf  [0.1uF Capacitor]
C21  0.1uf/100nf  [0.1uF Capacitor]
C22  22uF  [10uf Capacitor]
C23  22uF  [10uf Capacitor]
D6  BAT54HT1G  [SOD2513X110N]
D7  BAT54HT1G  [SOD2513X110N]
D8  BAT54HT1G  [SOD2513X110N]
D9  RED, 0805  [led red]  (value not drawn)
D10  RED, 0805  [led red]  (value not drawn)
J3  XT30U-F  [XT30UPB-F]
L1  2.2uH  [SWPA4030S]
L2  3.3uH  [SWPA5020]
Q3  SL2P10A  [P Mosfet SL2P10A]  (value not drawn)
R14  10k Ohm  [RESC2013X60X35ML10T20]
R15  10k Ohm  [RESC2013X60X35ML10T20]
R16  1k Ohm  [1k 0805 Resistor]
R17  33.2k Ohm  [1k 0805 Resistor]
R18  10k Ohm  [RESC2013X60X35ML10T20]
R19  10k Ohm  [RESC2013X60X35ML10T20]
R20  1k Ohm  [1k 0805 Resistor]
R21  54.9k Ohm  [1k 0805 Resistor]
R22  10k Ohm  [RESC2013X60X35ML10T20]
U3  TPS563201DDCR  [TPS563201DDCR]
U4  HT7833 3V3 Regulator  [HT7833]
U5  TPS563201DDCR  [TPS563201DDCR]
U6  AMS1117-5V  [AMS1117, 5V]

### Blocks framed on the sheet
3V3 Switching Regulator: C6-C10 D6 D7 D9 L1 R15-R18 U3
Battery Connector: D8 J3 Q3 R14
LDO 3V3: C11-C14 U4
5V Switching Regulator: C15 C18 C21-C23 D10 L2 R19-R22 U5
LDO 5V: C16 C17 C19 C20 U6

### Nets
+3V3: C7.2 C10.2 C11.2 C12.2 L1.2 R16.2 R17.2 U4.3(OUT)
+5V: C16.2 C17.2 C18.2 C23.2 L2.2 R20.2 R21.2 U6.2(OUT)
+5V_USB: D7.A
+BAT_V: D6.A D8.C(K) Q3.S
GND: C7.1 C8.1 C9.1 C10.1 C11.1 C12.1 C13.1 C14.1 C16.1 C17.1 C18.1 C19.1 C20.1 C21.1 C22.1 C23.1 D9.C D10.C J3.GND R14.1 R18.1 R22.1 U3.1(GND) U4.1(GND) U5.1(GND) U6.1(GND)
VIN: C8.2 C9.2 C13.2 C14.2 C19.2 C20.2 C21.2 C22.2 D6.C(K) D7.C(K) R15.1 R19.1 U3.3(VIN) U4.2(IN) U5.3(VIN) U6.3(IN)
NetC6_1: C6.1 U3.6(VBST)
NetC6_2: C6.2 L1.1 U3.2(SW)
NetC15_1: C15.1 U5.6(VBST)
NetC15_2: C15.2 L2.1 U5.2(SW)
NetD8_A: D8.A Q3.G R14.2
NetD9_A: D9.A R16.1
NetD10_A: D10.A R20.1
NetJ3_VIN: J3.VIN Q3.D
NetR15_2: R15.2 U3.5(EN)
NetR17_1: R17.1 R18.2 U3.4(VFB)
NetR19_2: R19.2 U5.5(EN)
NetR21_1: R21.1 R22.2 U5.4(VFB)

### Notes on the sheet
- Power Distribution <BMP280>
- 3/6 <BMP280>
- Shyam Rajendran <BMP280>

### Library data of the parts
C6 C15 = CC0805KKX7R6BB105: as C2 on sheet MCU; Supplier: Future Electronics; Supplier Part Number: 2015429; Manufacturer Part Number: CC0805KKX7R6BB105; RoHS: Yes; Category: Ceramic Capacitors; Stock: 114000; Pricing: 3000=0.0123, 9000=0.012, 30000=0.0117, 60000=0.0116, 120000=0.0112 (USD); Mounting Technology: Surface Mount; Pins: 2; Dielectric Material: Ceramic; Package Shape: Rectangular; Case/Package: 0805; Terminal Finish: Nickel; Min Operating Temperature: -55°C; Max Operating Temperature: 125°C; JESD-609 Code: e3; Value: 1uF; Capacitor Type: Ceramic; Tolerance  (fill in as +-): 10%; Packaging: Tape and Reel; Tolerance (fill in as +-): 10%; Rated DC Voltage (URdc): 10V; Temperature Characteristics Code: X7R; Termination: Wraparound; Package Style: SMTMeter; Length: 2mm; Width: 1.25mm; Height: 1.25mm; Reach SVHC Compliant: Yes; RoHS Compliant: Yes; ComponentLink1URL: https://datasheet.ciiva.com:443/pdfs/VipMasterIC/IC/YAGO/YAGO-S-A0003557223/YAGO-S-A0003557223-1.pdf?src-supplier=IHS+Markit; ComponentLink1Description: https://datasheet.ciiva.com:443/pdfs/VipMasterIC/IC/YAGO/YAGO-S-A0003557223/YAGO-S-A0003557223-1.pdf?src-supplier=IHS+Markit
C7 C9-C11 C16 C18 C22 C23 = 22uF Capacitor: CL21A226KOQNNNE-Samsang-16V 22uF X5R ±10% 0805 Multilayer Ceramic Capacitors MLCC – SMD/SMT ROHS
C8 C12 C14 C17 C20 C21 = CC0805KRX7R9BB104: as C1 on sheet MCU; Supplier: Future Electronics; Supplier Part Number: 2986263; Manufacturer Part Number: CC0805KRX7R9BB104; RoHS: Yes; Category: Ceramic Capacitors; Stock: 2884000; Pricing: 4000=0.009, 12000=0.0088, 40000=0.0085, 80000=0.0083, 160000=0.008 (USD); Mounting Technology: Surface Mount; Case/Package: 0805; Pins: 2; Case Code (Metric): 2012; Case Code (Imperial): 0805; Material: Ceramic; Min Operating Temperature: -55°C; Max Operating Temperature: 125°C; Packaging: Tape and Reel; Tolerance: 10%; Dielectric: X7R; Series: CC; Package Quantity: 4000; Voltage: 50V; Termination: SMD/SMT; Length: 2mm; Height: 0.85mm; Depth: 1.25mm; Radiation Hardening: No; RoHS Compliant: Yes; Lead Free: 5697LeadFree; Reach SVHC Compliant: No; Halogen Free: 5694HalogenFree
C13 C19 = GRM21BR61E106KA73L: 10uF, Multilayer Ceramic Capacitor, 25 V, ï¿½ 10%, X5R, 0805 [2012 Metric]; Manufacturer: Murata; Voltage Rating: 25V; Supplier: Mouser; Supplier Part Number: 81-GRM21BR61E106KA3L; Manufacturer Part Number: GRM21BR61E106KA73L; RoHS: Yes; Category: Ceramic Capacitors; Stock: 165824; Pricing: 1=0.13, 10=0.038, 50=0.038, 100=0.035, 1000=0.035, 10000=0.027 (USD); Mounting Technology: Surface Mount; Case/Package: 0805; Case Code (Metric): 2012; Case Code (Imperial): 0805; Material: Ceramic; Min Operating Temperature: -55°C; Max Operating Temperature: 85°C; Package Quantity: 1; Value: 10uF; Tolerance: 10%; Packaging: Tape and Reel; Voltage Rating (DC): 25V; Dielectric: X5R; Termination: SMD/SMT; Series: GRM; Voltage: 25V; Construction: Flat; Length: 2mm; Width: 0.049inch; Height: 1.25mm; Thickness: 0.053inch; Depth: 1.25mm; RoHS Compliant: Yes; Lead Free: 5697LeadFree; Reach SVHC Compliant: No; ComponentLink1URL: https://datasheet.ciiva.com/14116/grmseries-highdielectrictype-eng-14116376.pdf?src-supplier=Distrelec; ComponentLink1Description: https://datasheet.ciiva.com/14116/grmseries-highdielectrictype-eng-14116376.pdf?src-supplier=Distrelec; ComponentLink2URL: https://datasheet.ciiva.com/7719/1747469-7719093.pdf?src-supplier=Element14; ComponentLink2Description: https://datasheet.ciiva.com/7719/1747469-7719093.pdf?src-supplier=Element14
D6-D8 = BAT54HT1G: BAT54HT1G-ONSEMI-BAT54HT1G-Small Signal Schottky Diode, Single, 30 V, 200 mA, 800 mV, 600 mA, 150 °C; MF: Infineon Technologies; MP: BAS3010A03WE6327HTSA1; Price: None; Mouser-Purchase-URL: https://snapeda.com/shop?store=Mouser&id=447647; Value: *; Arrow_Electronics-Purchase-URL: https://snapeda.com/shop?store=Arrow+Electronics&id=447647; Package: SOD-323 Infineon; DigiKey-Purchase-URL: https://snapeda.com/shop?store=DigiKey&id=447647; SnapEDA_Link: https://www.snapeda.com/parts/BAS3010A03WE6327HTSA1/Infineon%20Technologies/view-part/447647/?ref=snap; Availability: Unavailable
D9 D10 = LED RED
J3 = XT30 Connector
L1 = 2.2uH Inductor: SWPA4030S2R2MT-Sunlord-2.2uH 2.95A 20% 39mOhm Shielded Wirewound Power Inductor SMD; Test Frequency: 1MHz; Max DC Current: 600mA; Core Material: Ferrite; DC Resistance (DCR): 340mR; Self Resonant Frequency: 50MHz; RoHS Compliant: Yes; Height: 0.5mm; Inductance: 2.2uH; Mount: Surface Mount; REACH SVHC: No SVHC; Width: 0.049inch; Military Standard: Not; Max Operating Temperature: 125°C; Lead Free: Lead Free; Tolerance: 20%; Series: LQM21PN_CO; Case Code (Imperial): 0805; Case Code (Metric): 2012; Length: 2mm; Package Quantity: 4000; Radiation Hardening: No; Termination: SMD/SMT; Inductance Tolerance: 20%; Rated Current-Max: 600mA; Current Rating: 600mA; Min Operating Temperature: -55°C; Case/Package: 0805; Height - Seated (Max): 0.022inch; Depth: 1.45mm; Packaging: Tape and Reel; Shielding: Shielded; DC Current: 600mA
L2 = 3.3uH Inductor: SWPA5020S3R3MT-Sunlord-3.3uH 2.5A 20% 56mOhm Shielded Wirewound Power Inductor SMD; Test Frequency: 1MHz; Inductance: 2.2uH; Max DC Current: 600mA; Core Material: Ferrite; DC Resistance (DCR): 340mR; Self Resonant Frequency: 50MHz; RoHS Compliant: Yes; Height: 0.5mm; Mount: Surface Mount; REACH SVHC: No SVHC; Width: 0.049inch; Military Standard: Not; Max Operating Temperature: 125°C; Lead Free: Lead Free; Tolerance: 20%; Series: LQM21PN_CO; Case Code (Imperial): 0805; Case Code (Metric): 2012; Length: 2mm; Package Quantity: 4000; Radiation Hardening: No; Termination: SMD/SMT; Inductance Tolerance: 20%; Rated Current-Max: 600mA; Current Rating: 600mA; Min Operating Temperature: -55°C; Case/Package: 0805; Height - Seated (Max): 0.022inch; Depth: 1.45mm; Packaging: Tape and Reel; Shielding: Shielded; DC Current: 600mA
Q3 = SL2P10A: MOSFET, Power,P-Ch,VDSS -20V,RDS(ON) 0.031Ohm,ID -3.7A,TO-236 (SOT-23),PD 0.75W | Siliconix / Vishay SI2323DS-T1-E3; MF: Vishay Siliconix; SnapEDA_Link: https://www.snapeda.com/parts/SI2323DS-T1-E3/Vishay/view-part/?ref=snap; Package: SOT-23-3 Vishay Siliconix; Value: *; MP: SI2323DS-T1-E3; Check_prices: https://www.snapeda.com/parts/SI2323DS-T1-E3/Vishay/view-part/?ref=eda
R14 R15 R18 R19 R22 = RC0805FR-0710KL: as R1 on sheet MCU; Supplier: Future Electronics; Supplier Part Number: 3310877; Manufacturer Part Number: RC0805FR-0710KL; RoHS: Yes; Category: Chip SMD Resistors; Stock: 15945000; Pricing: 5000=0.0021, 20000=0.002, 100000=0.0019, 200000=0.0018, 625000=0.0017 (USD); Case/Package: 0805; Case Code (Imperial): 0805; Case Code (Metric): 2012; Min Operating Temperature: -55°C; Max Operating Temperature: 155°C; Packaging: Tape and Reel; Tolerance: 1%; Termination: SMD/SMT; Number of Terminations: 2; Max Power Dissipation: 125mW; Features: Moisture Resistant; Series: RC; Resistor Type: Thick Film; Construction: Rectangular; Resistance Tolerance: 1%; Package Quantity: 1; Technology: THICK FILM; Voltage Rating (AC): 150V; Length: 0.079inch; Width: 0.049inch; Height: 0.024inch; Depth: 1.25mm; Lead Free: Lead Free; RoHS Compliant: Yes; Military Standard: Not; Reach SVHC Compliant: Unknown; ComponentLink1URL: https://datasheet.ciiva.com/11808/0900766b8106beab-11808151.pdf?src-supplier=Rs; ComponentLink1Description: https://datasheet.ciiva.com/11808/0900766b8106beab-11808151.pdf?src-supplier=Rs; ComponentLink2URL: https://datasheet.ciiva.com/46447/444164-46447563.pdf?src-supplier=Element14; ComponentLink2Description: https://datasheet.ciiva.com/46447/444164-46447563.pdf?src-supplier=Element14; ComponentLink3URL: https://datasheet.ciiva.com/2456/pyu-r-int-thick-7-2456973.pdf?src-supplier=Digikey; ComponentLink3Description: https://datasheet.ciiva.com/2456/pyu-r-int-thick-7-2456973.pdf?src-supplier=Digikey; ComponentLink4URL: https://datasheet.ciiva.com/2456/pyu-r-int-thick-7-2456974.pdf?src-supplier=Digikey; ComponentLink4Description: https://datasheet.ciiva.com/2456/pyu-r-int-thick-7-2456974.pdf?src-supplier=Digikey; ComponentLink5URL: https://datasheet.ciiva.com/2456/pyu-r-int-thick-7-2456972.pdf?src-supplier=Digikey; ComponentLink5Description: https://datasheet.ciiva.com/2456/pyu-r-int-thick-7-2456972.pdf?src-supplier=Digikey; ComponentLink6URL: https://datasheet.ciiva.com/12669/rc0805-12669688.pdf?src-supplier=Mouser; ComponentLink6Description: https://datasheet.ciiva.com/12669/rc0805-12669688.pdf?src-supplier=Mouser; ComponentLink7URL: https://datasheet.ciiva.com/16747/rc0805-16747087.pdf?src-supplier=Future+Electronics; ComponentLink7Description: https://datasheet.ciiva.com/16747/rc0805-16747087.pdf?src-supplier=Future+Electronics
R16 R20 = RC0805FR-071KL: as R10 on sheet USB; Supplier: Future Electronics; Supplier Part Number: 8126013; Manufacturer Part Number: RC0805FR-071KL; RoHS: Yes; Category: Chip SMD Resistors; Stock: 5450000; Pricing: 5000=0.0021, 20000=0.002, 100000=0.0019, 200000=0.0018, 625000=0.0017 (USD); Case/Package: 0805; Pins: 2; Case Code (Metric): 2012; Case Code (Imperial): 0805; Min Operating Temperature: -55°C; Max Operating Temperature: 155°C; Tolerance: 1%; Packaging: Tape and Reel; Voltage Rating (DC): 150V; Resistor Type: Thick Film; Series: RC; Number of Terminations: 2; Termination: SMD/SMT; Max Power Dissipation: 125mW; Resistance Tolerance: 1%; Package Quantity: 1; Features: Moisture Resistant; Construction: Rectangular; Voltage Rating (AC): 150V; Length: 0.079inch; Width: 0.049inch; Height: 0.024inch; Depth: 1.25mm; RoHS Compliant: Yes; Reach SVHC Compliant: No; Military Standard: Not; Lead Free: Lead Free
R17 = 33.2k Ohm: 0805
R21 = 54.9k Ohm: 0805
U3 U5 = TPS563201DDCR: 4.5 V to 17 V input, 3 A output, synchronous step-down converter in Eco-mode; MF: Texas Instruments; SnapEDA_Link: https://www.snapeda.com/parts/TPS563201DDCR/Texas+Instruments/view-part/?ref=snap; Package: SOT-23-THN-6 Texas Instruments; Value: *; MP: TPS563201DDCR; Check_prices: https://www.snapeda.com/parts/TPS563201DDCR/Texas+Instruments/view-part/?ref=eda
U4 = HT7833: 3V3 Voltage Regulator
U6 = AMS1117-5V: SOT89